# Altium schematic sheet Battery_Mnitor.SchDoc
size A4
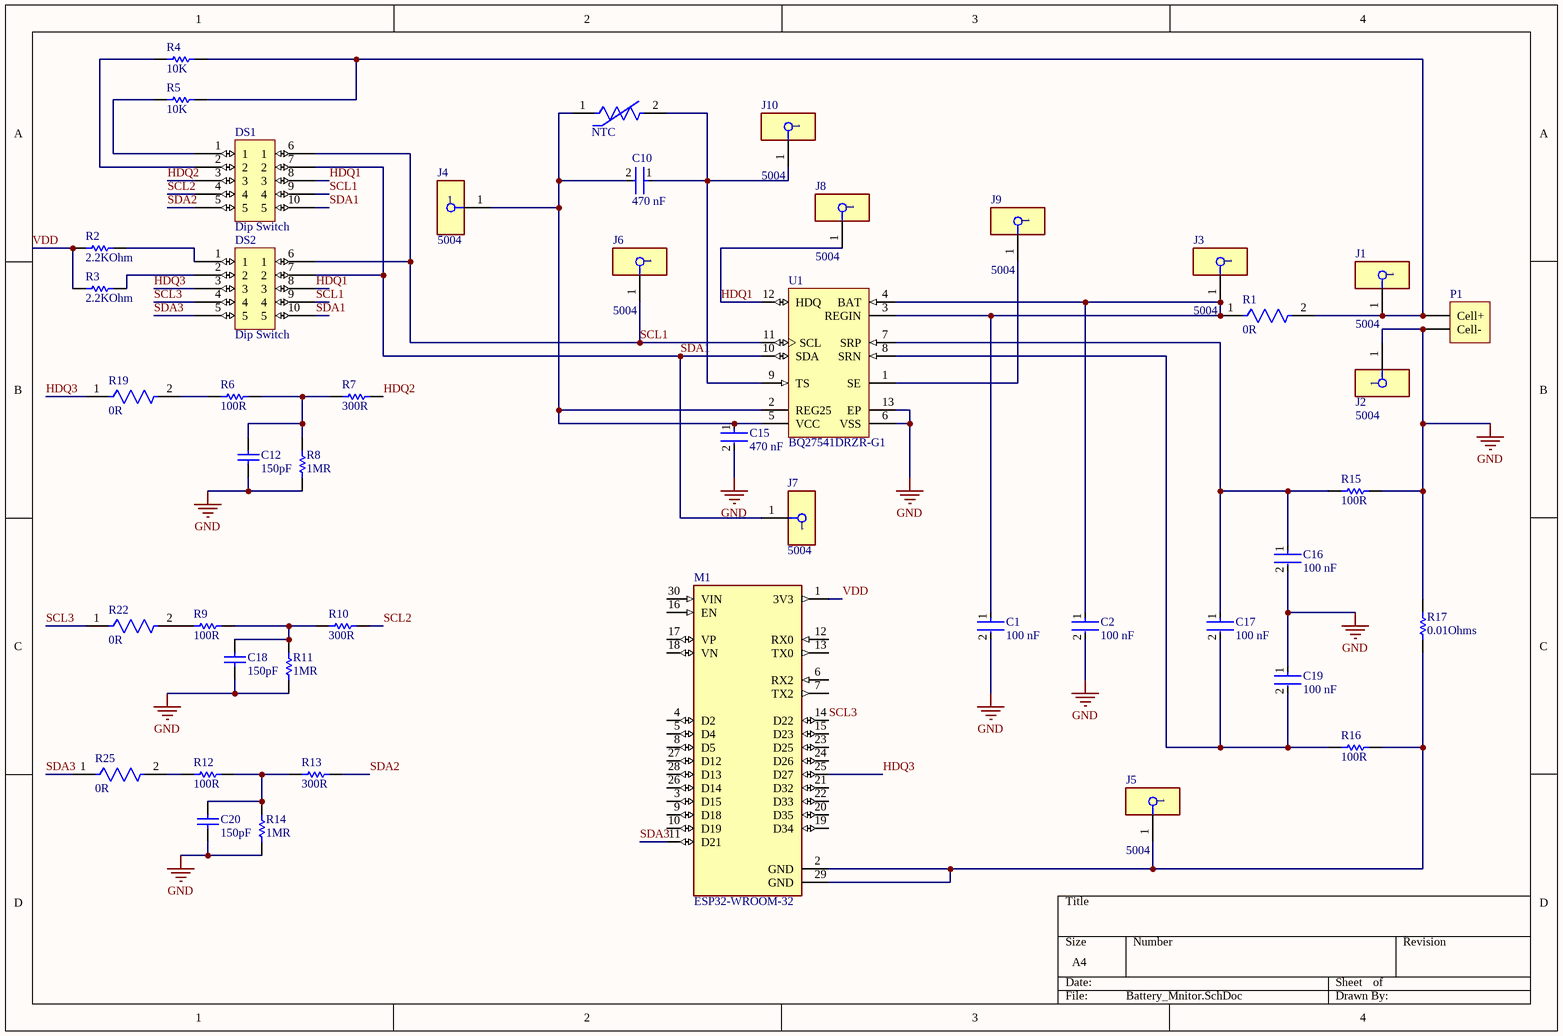
[diagram p0: Battery_Mnitor.SchDoc]

## Parts
C1  100 nF  [FP-CC0402-MFG]
C2  100 nF  [FP-CC0402-MFG]
C10  470 nF  [FP-CC0402-MFG]
C12  150pF  [CAPC1005X55X25LL05T10]
C15  470 nF  [FP-CC0402-MFG]
C16  100 nF  [FP-CC0402-MFG]
C17  100 nF  [FP-CC0402-MFG]
C18  150pF  [CAPC1005X55X25LL05T10]
C19  100 nF  [FP-CC0402-MFG]
C20  150pF  [CAPC1005X55X25LL05T10]
DS1  Dip Switch  [DIP10]
DS2  Dip Switch  [DIP10]
J1  5004  [FP-5004-MFG]
J2  5004  [FP-5004-MFG]
J3  5004  [FP-5004-MFG]
J4  5004  [FP-5004-MFG]
J5  5004  [FP-5004-MFG]
J6  5004  [FP-5004-MFG]
J7  5004  [FP-5004-MFG]
J8  5004  [FP-5004-MFG]
J9  5004  [FP-5004-MFG]
J10  5004  [FP-5004-MFG]
M1  ESP32-WROOM-32  [ESP32-DEVKIT-V1]
NTC  NXRT15XH103FA1B030  [FP-NXR_151B030-MFG]  (value not drawn)
P1  Header 2H  [HDR1X2H]  (value not drawn)
R1  0R  [FP-RC0402-0_4-IPC_A]
R2  2.2KOhm  [RESC3116X65X40ML10T20]
R3  2.2KOhm  [RESC3116X65X40ML10T20]
R4  10K  [RESC1005X40X25LL05T10]
R5  10K  [RESC1005X40X25LL05T10]
R6  100R  [RESC1005X40X25ML05T10]
R7  300R  [RESC1005X40X25LL05T10]
R8  1MR  [RESC1005X40X25NL05T10]
R9  100R  [RESC1005X40X25ML05T10]
R10  300R  [RESC1005X40X25LL05T10]
R11  1MR  [RESC1005X40X25NL05T10]
R12  100R  [RESC1005X40X25ML05T10]
R13  300R  [RESC1005X40X25LL05T10]
R14  1MR  [RESC1005X40X25NL05T10]
R15  100R  [RESC1005X40X25ML05T10]
R16  100R  [RESC1005X40X25ML05T10]
R17  0.01Ohms  [RESC5125X89X51LL25T25]
R19  0R  [FP-RC0402-0_4-IPC_A]
R22  0R  [FP-RC0402-0_4-IPC_A]
R25  0R  [FP-RC0402-0_4-IPC_A]
U1  BQ27541DRZR-G1  [DRZ0012A_V]

## Nets
GND: C1.2 C2.2 C12.1 C15.2 C16.2 C18.1 C19.1 C20.1 J2.1 P1.2(Cell-) R8.1 R11.1 R14.1 R15.2 R17.2 U1.6(VSS) U1.13(EP)
HDQ1: DS1.8(3) DS2.8(3) J8.1 U1.12(HDQ)
HDQ2: DS1.3 R7.2
HDQ3: DS2.3 M1.25(D27) R19.1
SCL1: DS1.6(1) DS1.9(4) DS2.6(1) DS2.9(4) J6.1 U1.11(SCL)
SCL2: DS1.4 R10.2
SCL3: DS2.4 M1.14(D22) R22.1
SDA1: DS1.7(2) DS1.10(5) DS2.7(2) DS2.10(5) J7.1 U1.10(SDA)
SDA2: DS1.5 R13.2
SDA3: DS2.5 M1.11(D21) R25.1
VDD: M1.1(3V3) R2.1 R3.1
NetC1_1: C1.1 C2.1 J3.1 R1.1 U1.3(REGIN) U1.4(BAT)
NetC10_1: C10.1 J10.1 NTC.2 U1.9(TS)
NetC10_2: C10.2 C15.1 J4.1 NTC.1 U1.2(REG25) U1.5(VCC)
NetC12_2: C12.2 R6.2 R7.1 R8.2
NetC16_1: C16.1 C17.1 R15.1 U1.7(SRP)
NetC17_2: C17.2 C19.2 R16.1 U1.8(SRN)
NetC18_2: C18.2 R9.2 R10.1 R11.2
NetC20_2: C20.2 R12.2 R13.1 R14.2
NetDS1_1: DS1.1 R5.2
NetDS1_2: DS1.2 R4.2
NetDS2_1: DS2.1 R2.2
NetDS2_2: DS2.2 R3.2
NetJ1_1: J1.1 P1.1(Cell+) R1.2 R4.1 R5.1
NetJ5_1: J5.1 M1.2(GND) M1.29(GND) R16.2 R17.1
NetJ9_1: J9.1 U1.1(SE)
NetR6_1: R6.1 R19.2
NetR9_1: R9.1 R22.2
NetR12_1: R12.1 R25.2

Not connected (* = marked no-connect by the designer): M1 3(D15) 4(D2) 5(D4) 6(RX2) 7(TX2) 8(D5) 9(D18) 10(D19) 12(RX0) 13(TX0) 15(D23) 16(EN) 17(VP) 18(VN) 19(D34) 20(D35) 21(D32) 22(D33) 23(D25) 24(D26) 26(D14) 27(D12) 28(D13) 30(VIN)

## Library data of the parts
C1 C2 C16 C17 C19 = CMP-03422-000048-1: CAP CER 0.1UF 16V X7R 0402; Manufacturer: YAGEO; Mfr. Part #: CC0402KRX7R7BB104; Material: Ceramic; Automotive Grade: NA; Temperature Coefficient: 30ppm/°C; Description: CC0402 100 nF X7R 10.00% 16 V; Tolerance: 0.1; Device Class L1: Passive Components; Temperature Range Low: -55°C; Device Class L3: Ceramic Capacitors; Temperature Characteristic: X7R; Ipc Land Pattern Name: CAPC10050X50; Capacitance: 100 nF; Temperature Range High: +125°C; Voltage Rating: 16 V; Temperature: -55°C to +125°C; RoHS: TRUE; Automotive: No; Height: 0.55mm; Device Class L2: Capacitors; Digikey Description: CAP CER 0.1UF 16V X7R 0402; Package: CC0402; Footprint Url: http://www.yageo.com/exep/pages/download/literatures/UPY-C_GEN_24.pdf; ComponentLink2Description: Datasheet; Category: Cap; Lead Free: Yes; Value: 100 nF; Octopart: https://octopart.com/cc0402krx7r7bb104-yageo-42244624; ComponentLink2URL: http://www.yageo.com/documents/recent/UPY-GP_NP0_16V-to-50V_16.pdf; Mouser Description: 0402 0.1 uF 16 V ±10 % Tolerance X7R SMT Multilayer Ceramic Capacitor; LCSC Part #: C60474
C10 C15 = CMP-03422-001152-1: CC0402 470 nF X5R 10.00% 25 V; Manufacturer: YAGEO; Mfr. Part #: CC0402KRX5R8BB474; Tolerance: 0.1; Temperature Coefficient: 30ppm/°C; Voltage Rating: 25 V; Automotive Grade: NA; Material: Ceramic; Temperature Characteristic: X5R; Category: Cap; Ipc Land Pattern Name: CAPC10050X50; Height: 0.55mm; Value: 470 nF; Device Class L3: Ceramic Capacitors; Device Class L1: Passive Components; Temperature: -55°C to +125°C; ComponentLink2URL: http://www.yageo.com/documents/recent/UPY-GP_NP0_16V-to-50V_16.pdf; Device Class L2: Capacitors; Package: CC0402; Footprint Url: http://www.yageo.com/exep/pages/download/literatures/UPY-C_GEN_24.pdf; Lead Free: Yes; Temperature Range Low: -55°C; Octopart: https://octopart.com/cc0402krx5r8bb474-yageo-77039652; Mouser Description: Cap Ceramic 0.47uF 25VDC X5R 10% SMD 0402 85°C Paper T/R; ComponentLink2Description: Datasheet; Capacitance: 470 nF; RoHS: TRUE; Temperature Range High: +125°C; Automotive: No; LCSC Part #: C541475
C12 C18 C20 = CMP-2008-04269-1: 50V 150pF C0G ±5% 0402 Multilayer Ceramic Capacitors MLCC - SMD/SMT ROHS; Manufacturer: Murata; Mfr. Part #: GRM1555C1H151JA01D; LCSC Part #: C76951; Package: 0402; Capacitance: 150pF; Voltage: 50V; Tolerance: 5%; Value: 150pF
DS1 DS2 = DS-05RP: SPST 24V 25mA Red -20℃~+70℃ 3000 Flat dial, raised type 2.54mm 6 Plugin DIP Switches ROHS; Manufacturer: Korean Hroparts Elec; LCSC Part #: C129061; Mfr. Part #: DS-05RP; Package: Plugin
J1-J10 = CMP-2000-05575-2: PC TEST POINT MINIATURE YELLOW; Manufacturer: Keystone; Number Of Contacts: 1; Is Female: yes; Device Class L1: Connectors; Mfr. Part #: 5004; Digikey Description: PC TEST POINT MINIATURE YELLOW; ComponentLink2URL: https://www.keyelco.com/product-pdf.cfm?p=1313; Lead Free: Yes; ComponentLink2Description: Datasheet; Category: Conn; Height: 4.72mm; Octopart: https://octopart.com/5004-keystone-28591; Mouser Description: TEST POINT PC MINI .040"D YELLOW; Device Class L3: unset; Contact Material: Silver; Package: 5004; Automotive: No; Device Class L2: unset; RoHS: TRUE; LCSC Part #: C2906762
M1 = ESP32-DEVKIT-V1: Dual core, Wi-Fi: 2.4 GHz up to 150 Mbits/s,BLE (Bluetooth Low Energy) and legacy Bluetooth, 32 bits, Up to 240 MHz
NTC = CMP-06022-001050-1: Thermistor NTC 10kΩ ±1% 2-Pin Radial Bulk; Manufacturer: Murata Electronics; Resistance: 10kR; Max Power Dissipation: 7.5mW; Lead Diameter: 0.4mm; RoHS Compliant: Yes; Number of Pins: 2; Lead Free: Lead Free; Height: 2mm; Lead Pitch: 2.5mm; Power Rating: 7.5mW; Series: NXR; Packaging: Bulk; Package Quantity: 500; Width: 4mm; Max Operating Temperature: 125°C; Termination: Radial; Min Operating Temperature: -40°C; Tolerance: 1%; Resistance Tolerance: 1%; Length: 5mm; Mount: Through Hole; Mfr. Part #: NXRT15XH103FA1B030; LCSC Part #: C152559; Package: Radial Leaded
P1 = Header 2H: Header, 2-Pin, Right Angle; LatestRevisionDate: 17-Jul-2002; LatestRevisionNote: Re-released for DXP Platform.; Publisher: Altium Limited
R1 R19 R22 R25 = CMP-2002-07342-2: RES SMD 0 OHM JUMPER 1/16W 0402; Mfr. Part #: RC0402FR-070RL; Manufacturer: YAGEO; Temperature Coefficient: 200ppm/°C; Tolerance: 1%; Power Rating: 62.5mW; Voltage Rating: 50V; Max Power Dissipation: 63mW; Resistance: 0R; Features: Moisture Resistant; Length: 1mm; Case Code (Metric): 1005; Series: RC; RoHS Compliant: Yes; Resistor Type: Thick Film; Height: 0.35mm; Min Operating Temperature: -55°C; Case Code (Imperial): 0402; Number of Terminations: 2; Contact Plating: Tin; Package: 0402; Size Code: 0402; Termination: SMD/SMT; Max Operating Temperature: 155°C; Width: 0.5mm; Mount: Surface Mount; Lead Free: Lead Free; Packaging: Tape and Reel; Radiation Hardening: No; LCSC Part #: C106231; Value: 0R
R2 R3 = CMP-1014-00546-2: Chip Resistor, 2.2 KOhm, +/- 1%, 250 mW, -55 to 155 degC, 1206 (3216 Metric), RoHS, Tape and Reel; Manufacturer: Yageo; Mfr. Part #: RC1206FR-072K2L; Power Rating: 250mW; Voltage Rating: 200V; Temperature Coefficient: 100ppm/degreesC; RoHSCompliant: true; Packaging: TapeandReel; Termination: SMD/SMT; Package: 1206; Case Code (Imperial): 1206; Manufacturer URL: http://www.yageo.com/; Max Power Dissipation: 250mW; Resistance: 2.2KOhm; Tolerance: 1%; Package Reference: 1206.0; Number of Terminations: 2; Depth: 1.6mm; Case Code (Metric): 3216; Lead Free: LeadFree; REACH SVHC: Unknown; Package Quantity: 1; Datasheet Version: Rev. 5, 10/2016; Length: 3.1mm; Weight: 0.000571oz; Composition: ThickFilm; Width: 0.063inch; Max Operating Temperature: 155degC; Package Description: 2-Pin Surface Mount Device, Body 3.1 x 1.6 mm; Min Operating Temperature: -55degC; Height: 0.55mm; Datasheet URL: http://www.yageo.com/NewPortal/yageodocoutput?fileName=/pdf/R-Chip/PYu-RC_Group_51_RoHS_L_5.pdf; Military Standard: Not; LCSC Part #: C114933; Value: 2.2KOhm
R4 R5 = CMP-2002-07353-1: Manufacturer: Yageo / Phycomp; Mfr. Part #: RC0402FR-0710KL; Power: 1/16W; LCSC Part #: C60490; Package: 0402; Resistance: 10K; Value: 10K
R6 R9 R12 R15 R16 = CMP-2002-07344-1: 62.5mW Thick Film Resistors 50V ±100ppm/℃ ±1% -55℃~+155℃ 100Ω 0402 Chip Resistor - Surface Mount ROHS; Mfr. Part #: RC0402FR-07100RL; Manufacturer: Yageo / Phycomp; Power (Watts): 1/16W; LCSC Part #: C106232; Package: 0402; Tolerance: ±1%; Value: 100R
R7 R10 R13 = CMP-2002-07009-1: 62.5mW Thick Film Resistors 50V ±100ppm/℃ ±1% -55℃~+155℃ 300Ω 0402 Chip Resistor - Surface Mount ROHS; Mfr. Part #: RC0402FR-07300RL; Manufacturer: Yageo / Phycomp; Power (Watts): 63mW; LCSC Part #: C138010; Package: 0402; Tolerance: 1%; Value: 300R; Resistance: 300R
R8 R11 R14 = CMP-2002-07490-1: 62.5mW 50V ±100ppm/℃ ±1% -55℃~+155℃ 1MΩ 0402 Chip Resistor - Surface Mount ROHS; Manufacturer: Yageo / Phycomp; Mfr. Part #: RC0402FR-071ML; Power (Watts): 63mW; LCSC Part #: C138033; Package: 0402; Tolerance: 1%; Value: 1MR
R17 = CMP-2000-07418-1: Chip Resistor, 10 mOhm, +/- 1%, 0.5 W, -65 to 170 degC, 2010 (5025 Metric), RoHS, Tape and Reel; Manufacturer: Vishay; Mfr. Part #: WSL2010R0100FEA; Unit Weight: 0.001372oz; Temperature Coefficient: 75PPM/C; Case Width: 2.5mm; Case Length: 5mm; Case Height: 0.635mm; Brand: Vishay/Dale; Power Rating: 500mW(1/2W); Datasheet Version: 07/2016; Package Reference: 2010; Factory Pack Quantity: 4000; Manufacturer URL: http://www.vishay.com/; Series: WSL; Operating Temperature Range: -65Cto+170C; Mounting Technology: SurfaceMount; Package Description: 2-Pin Surface Mount Device, Body 5.08 x 2.54 mm; Product Category: CurrentSenseResistors-SMD; Type: PowerMetalStripResistors,LowValue(downto0.0005Ohms),SurfaceMount; Product: MetalElementCurrentSensingResistors; Datasheet URL: http://www.vishay.com/docs/30100/wsl.pdf; Resistance: 0.01Ohms; Package: 2010(5025metric); Packaging: Reel; Termination Style: SMD/SMT; Case Code - mm: 5025; Case Code - in: 2010; RoHS: Details; Tradename: PowerMetalStrip; Tolerance: 1%; LCSC Part #: C844897; Value: 0.01Ohms
U1 = CMP-0321-00448-2: Pack-Side Impedance Track Battery Fuel Gauge with Integrated LDO, -40 to 85 degC, 12-pin SON (DRZ), Green (RoHS & no Sb/Br); Manufacturer: Texas Instruments; NiMH: N; Li-Polymer: Y; DatasheetVersion: SLUSAL6B; PackageVersion: revB, Apr-2006; Eco-Plan: Green (RoHS & no Sb/Br); NiCd: N; PackageReference: DRZ0012A; Mounting Technology: Surface Mount; PackageDescription: 12-Pin Plastic Small Outline No-Lead, 4 x 2.5 x 1 mm Body, 0.4 mm Pitch, Exposed Pad, Pb-Free; Over Voltage Protection: N; Lead Acid: N; SubFamily: Battery Fuel Gauge; ComponentLink1Description: Datasheet; ComponentLink1URL: http://www.ti.com/general/docs/lit/getliterature.tsp?genericPartNumber=BQ27541-G1&fileType=pdf; PartNumber: BQ27541DRZR-G1; Li-Ion: Y